# Altium schematic sheet Sensor_Box_PWR_Backup.SchDoc: Title
size 420 x 297 mm; Author: G.Kasprowicz; CompanyName: WUT ISE; DrawnBy: G.Kasprowicz; Organization: WUT ISE; Address1: PW ISE; Address2: Nowowiejska 15/19 00-665 Warsaw; Address3: gkasprow@gmail.com; Revision: 1.0; SheetNumber: -; SheetTotal: -; ModifiedBy: -; CheckedDate: -; Title2: Title2; DivGrp: WUT ISE; Designer: G.Kasprowicz; ModifiedDate: -; ProjectName: Sensor Box
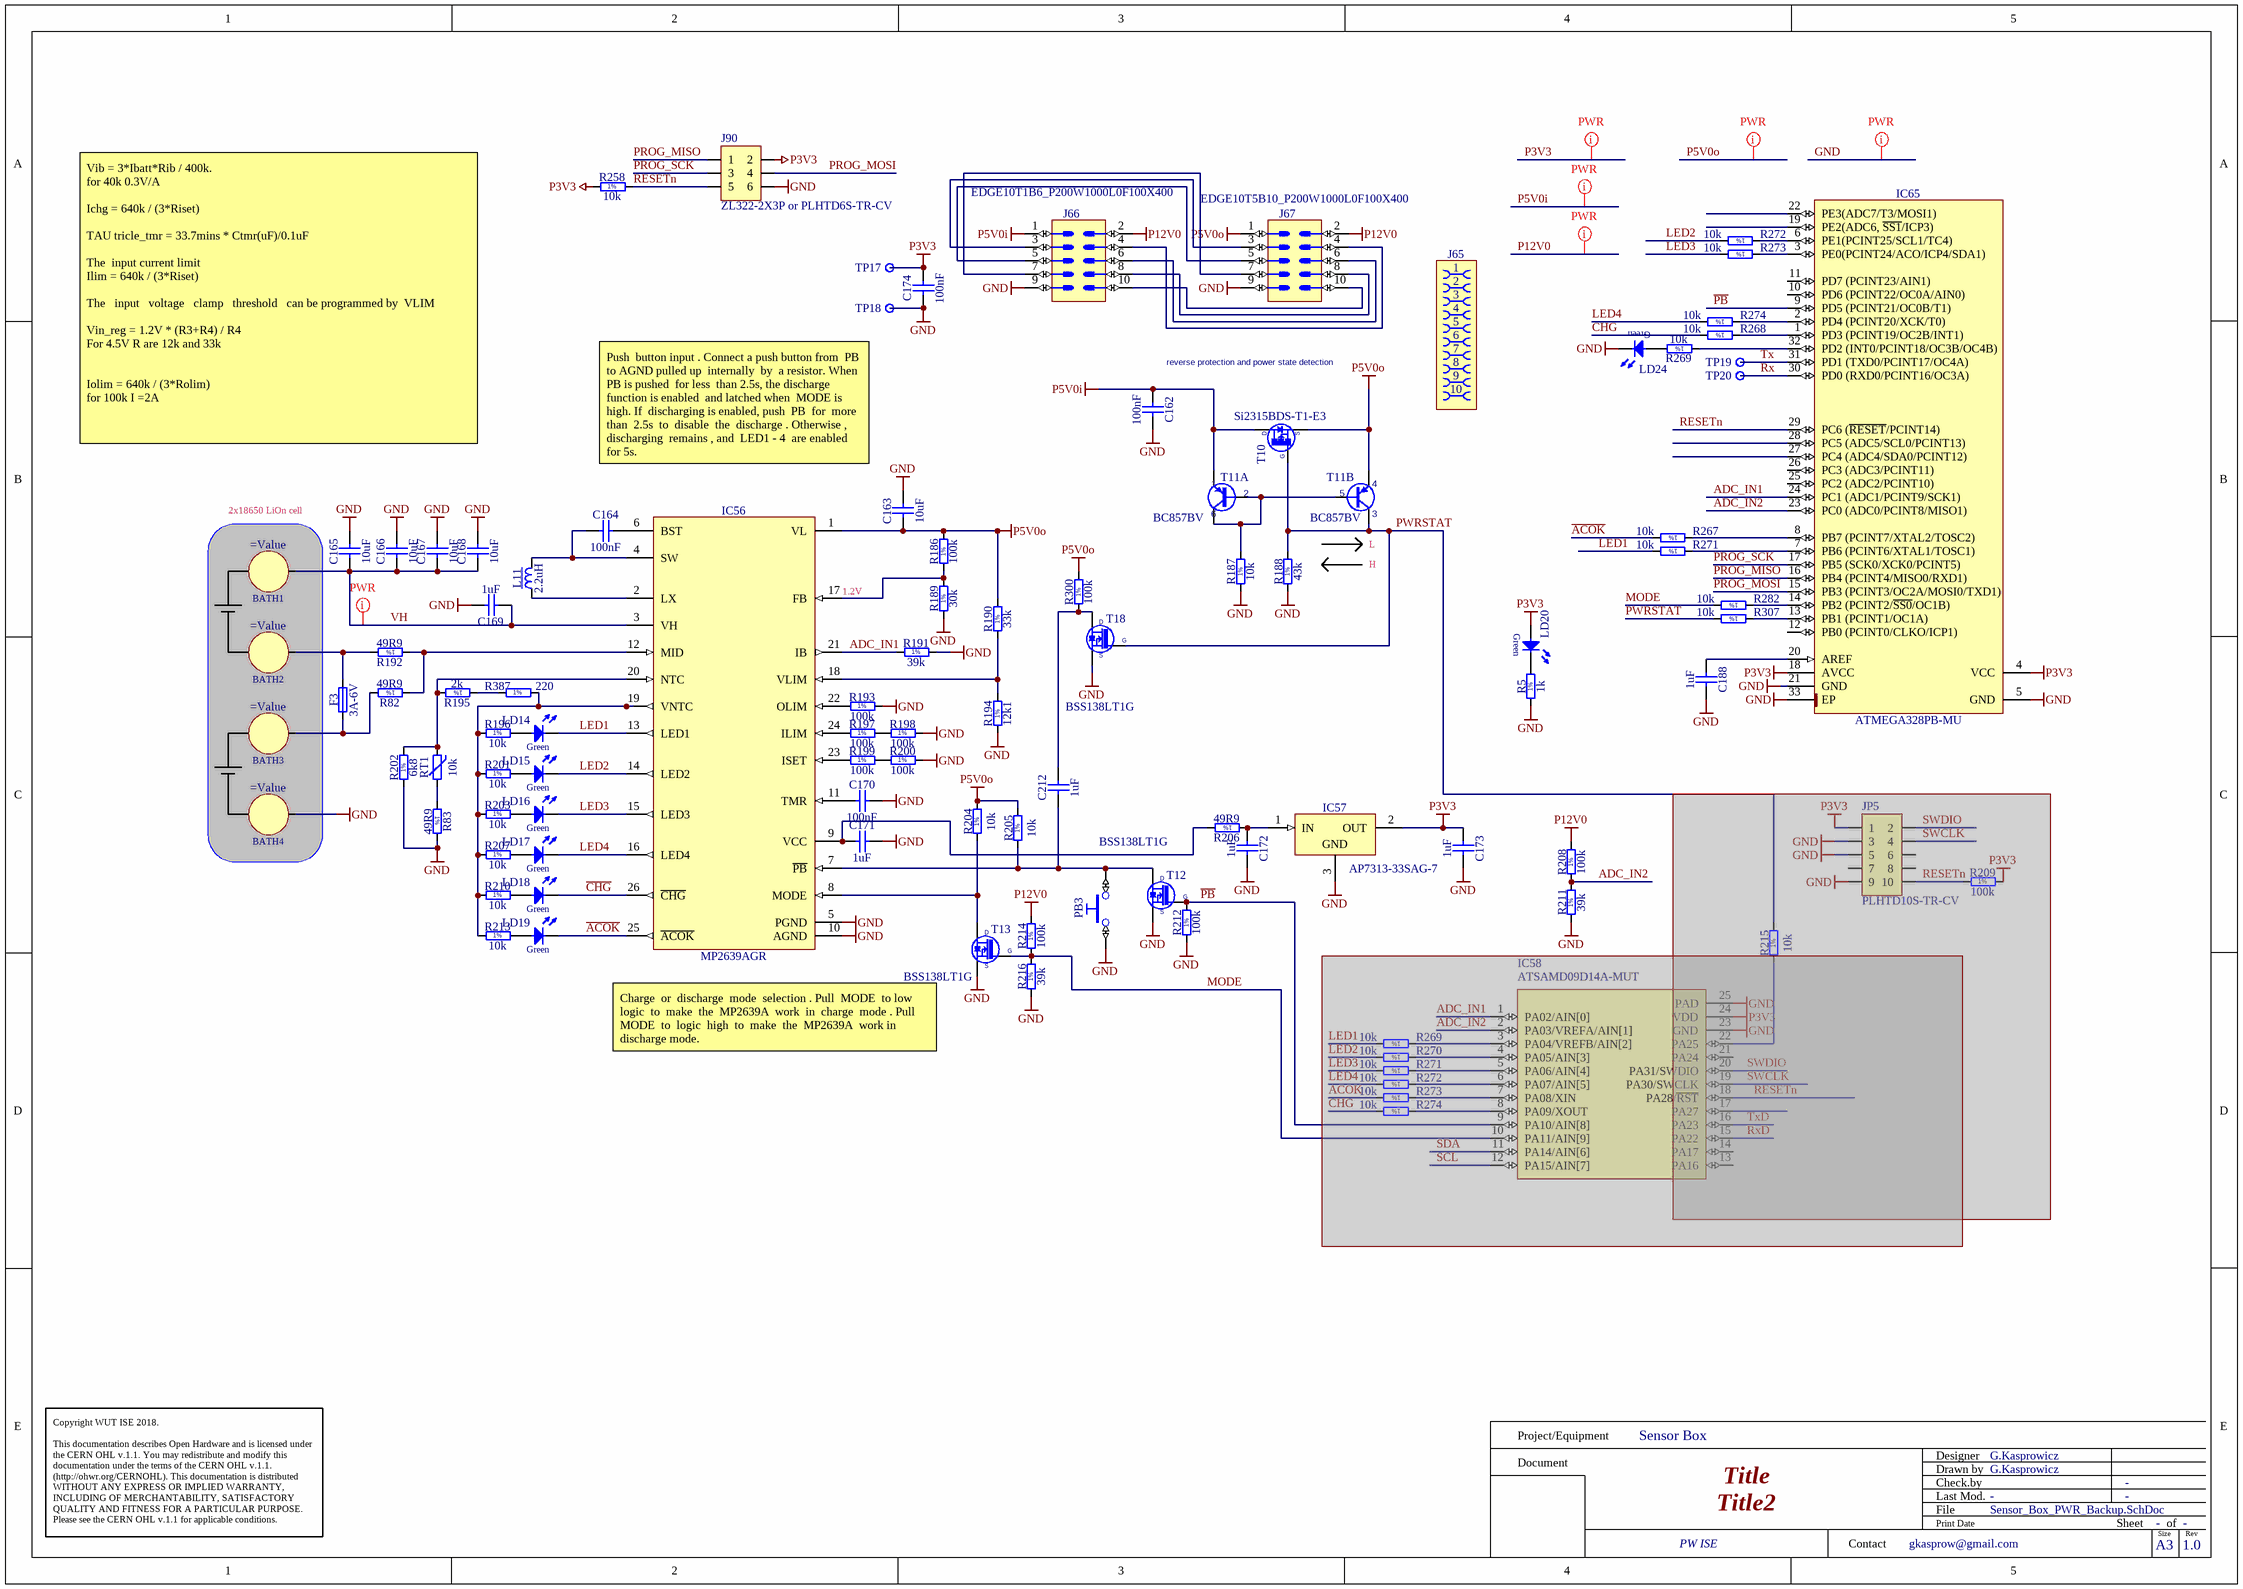
[diagram p0: Sensor_Box_PWR_Backup.SchDoc]

## Parts
(Parts that share a designator on the sheet are numbered #1, #2 ... from top to bottom, then left to right.)
BATH1  (no value)  [BATH_KEYSTONE_54]
BATH2  (no value)  [BATH_KEYSTONE_54]
BATH3  (no value)  [BATH_KEYSTONE_54]
BATH4  (no value)  [BATH_KEYSTONE_54]
C162  100nF  [CAPC1005X55N]
C163  10uF  [CAPC2012X135N]
C164  100nF  [CAPC1005X55N]
C165  10uF  [CAPC2012X135N]
C166  10uF  [CAPC2012X135N]
C167  10uF  [CAPC2012X135N]
C168  10uF  [CAPC2012X135N]
C169  1uF  [CAPC1005X55N]
C170  100nF  [CAPC1005X55N]
C171  1uF  [CAPC1005X55N]
C172  1uF  [CAPC1005X55N]
C173  1uF  [CAPC1005X55N]
C174  100nF  [CAPC1005X55N]
C188  1uF  [CAPC1005X55N]
C212  1uF  [CAPC1005X55N]
F3  3A-6V  [FUSR_BOURNS_MF-SM300]
IC56  MP2639AGR  [MPS_MP2639AGR]
IC57  AP7313-33SAG-7  [SOT95P240X130-3N]
IC58  ATSAMD09D14A-MUT  [QFN50P400X400X80_HS-25N]  (masked out: inside a compile mask, not in the netlist)
IC65  ATMEGA328PB-MU  [QFN50P500X500X100-33N-S325]
J65  (no value)  [AVX_00 9159 010 061 916]
J66  (no value)  [EDGE10T1B6_P200W1000L0F100X400]
J67  (no value)  [EDGE10T5B10_P200W1000L0F100X400]
J90  ZL322-2X3P or PLHTD6S-TR-CV  [ZL322-2X3P]
JP5  PLHTD10S-TR-CV  [PLHTD10S-TR-CV]  (masked out: inside a compile mask, not in the netlist)
L11  2.2uH  [IND_BOURNS_SRU5028]
LD14  Green  [LED_KINGBRIGHT_KPTR3216]  (value not drawn)
LD15  Green  [LED_KINGBRIGHT_KPTR3216]  (value not drawn)
LD16  Green  [LED_KINGBRIGHT_KPTR3216]  (value not drawn)
LD17  Green  [LED_KINGBRIGHT_KPTR3216]  (value not drawn)
LD18  Green  [LED_KINGBRIGHT_KPTR3216]  (value not drawn)
LD19  Green  [LED_KINGBRIGHT_KPTR3216]  (value not drawn)
LD20  Green  [LED_KINGBRIGHT_KPTR3216]  (value not drawn)
LD24  Green  [LED_KINGBRIGHT_KPTR3216]  (value not drawn)
PB3  Push Button  [PB_TYCO_FSMSM]  (value not drawn)
R5  1k  [RESC1005X40N]
R82  49R9  [RESC1005X40N]
R83  49R9  [RESC1005X40N]
R186  100k  [RESC1005X40N]
R187  10k  [RESC1005X40N]
R188  43k  [RESC1608X55N]
R189  30k  [RESC1005X40N]
R190  33k  [RESC1005X40N]
R191  39k  [RESC1005X40N]
R192  49R9  [RESC1005X40N]
R193  100k  [RESC1005X40N]
R194  12k1  [RESC1005X40N]
R195  2k  [RESC1005X40N]
R196  10k  [RESC1005X40N]
R197  100k  [RESC1005X40N]
R198  100k  [RESC1005X40N]
R199  100k  [RESC1005X40N]
R200  100k  [RESC1005X40N]
R201  10k  [RESC1005X40N]
R202  6k8  [RESC1005X40N]
R203  10k  [RESC1005X40N]
R204  10k  [RESC1005X40N]
R205  10k  [RESC1005X40N]
R206  49R9  [RESC1005X40N]
R207  10k  [RESC1005X40N]
R208  100k  [RESC1005X40N]
R209  100k  [RESC1005X40N]  (masked out: inside a compile mask, not in the netlist)
R210  10k  [RESC1005X40N]
R211  39k  [RESC1005X40N]
R212  100k  [RESC1005X40N]
R213  10k  [RESC1005X40N]
R214  100k  [RESC1005X40N]
R215  10k  [RESC1005X40N]  (masked out: inside a compile mask, not in the netlist)
R216  39k  [RESC1005X40N]
R258  10k  [RESC1005X40N]
R267  10k  [RESC1005X40N]
R268  10k  [RESC1005X40N]
R269#1  10k  [RESC1005X40N]
R269#2  10k  [RESC1005X40N]  (masked out: inside a compile mask, not in the netlist)
R270  10k  [RESC1005X40N]  (masked out: inside a compile mask, not in the netlist)
R271#1  10k  [RESC1005X40N]
R271#2  10k  [RESC1005X40N]  (masked out: inside a compile mask, not in the netlist)
R272#1  10k  [RESC1005X40N]
R272#2  10k  [RESC1005X40N]  (masked out: inside a compile mask, not in the netlist)
R273#1  10k  [RESC1005X40N]
R273#2  10k  [RESC1005X40N]  (masked out: inside a compile mask, not in the netlist)
R274#1  10k  [RESC1005X40N]
R274#2  10k  [RESC1005X40N]  (masked out: inside a compile mask, not in the netlist)
R282  10k  [RESC1005X40N]
R300  100k  [RESC1005X40N]
R307  10k  [RESC1005X40N]
R387  220  [RESC1005X40N]
RT1  10k  [THERMC1608X90N]
T10  Si2315BDS-T1-E3  [SOT95P237X112-3N]
T11  BC857BV  [SOTFL50P160X60-6N]  (parts A,B of 2)
T12  BSS138LT1G  [SOT95P240X110-3N]
T13  BSS138LT1G  [SOT95P240X110-3N]
T18  BSS138LT1G  [SOT95P240X110-3N]
TP17  Test Point  [TPS127]  (value not drawn)
TP18  Test Point  [TPS127]  (value not drawn)
TP19  Test Point  [TPS127]  (value not drawn)
TP20  Test Point  [TPS127]  (value not drawn)

## Blocks framed on the sheet
2x18650 LiOn cell: BATH1-BATH4

## Nets
GND: BATH4.1(PLUS) C162.2 C163.2 C165.2 C166.2 C167.2 C168.2 C169.2 C170.2 C171.2 C172.2 C173.2 C174.1 C188.2 IC56.5(PGND) IC56.10(AGND) IC57.3(GND) IC65.5(GND) IC65.21(GND) IC65.33(EP) J66.9 J67.9 J90.6 LD24.1(C) PB3.1 R5.1 R83.2 R187.1 R188.1 R189.1 R191.2 R193.2 R194.1 R198.2 R200.2 R202.1 R211.1 R212.1 R216.1 T12.2(S) T13.2(S) T18.2(S) TP18.1
P3V3: C173.1 C174.2 IC57.2(OUT) IC65.4(VCC) IC65.18(AVCC) J90.2 LD20.2(A) R258.1 TP17.1
P5V0i: C162.1 J66.1 T10.3(D) T11.1(E)
P5V0o: C163.1 IC56.1(VL) J67.1 R186.2 R190.2 R204.2 R205.2 R300.2 T10.2(S) T11.4(E)
P12V0: J66.2 J67.2 R208.2 R214.2
~{ACOK}: IC56.25(~{ACOK}) LD19.1(C) R267.2
ADC_IN1: IC56.21(IB) IC65.24(PC1_(ADC1/PCINT9/SCK1)) R191.1
ADC_IN2: IC65.23(PC0_(ADC0/PCINT8/MISO1)) R208.1 R211.2
~{CHG}: IC56.26(~{CHG}) LD18.1(C) R268.2
LED1: IC56.13(LED1) LD14.1(C) R271#1.2
LED2: IC56.14(LED2) LD15.1(C) R272#1.2
LED3: IC56.15(LED3) LD16.1(C) R273#1.2
LED4: IC56.16(LED4) LD17.1(C) R274#1.2
MODE: R214.1 R216.2 R282.2 T13.1(G)
~{PB}: IC65.9(PD5_(PCINT21/OC0B/T1)) R212.2 T12.1(G)
PROG_MISO: IC65.16(PB4_(PCINT4/MISO0/RXD1)) J90.1
PROG_MOSI: IC65.15(PB3_(PCINT3/OC2A/MOSI0/TXD1)) J90.4
PROG_SCK: IC65.17(PB5_(SCK0/XCK0/PCINT5)) J90.3
PWRSTAT: R188.2 R307.2 T10.1(G) T11.3(C) T18.1(G)
RESETn: IC65.29(PC6_(~{RESET}/PCINT14)) J90.5 R258.2
Rx: IC65.30(PD0_(RXD0/PCINT16/OC3A)) TP20.1
Tx: IC65.31(PD1_(TXD0/PCINT17/OC4A)) TP19.1
VH: BATH1.1(PLUS) C165.1 C166.1 C167.1 C168.1 C169.1 IC56.3(VH)
NetBATH2_1: BATH2.1(PLUS) F3.2 R192.2
NetBATH3_1: BATH3.1(PLUS) F3.1 R82.2
NetC164_1: C164.1 IC56.4(SW) L11.2
NetC164_2: C164.2 IC56.6(BST)
NetC170_1: C170.1 IC56.11(TMR)
NetC171_1: C171.1 IC56.9(VCC) R206.2
NetC172_1: C172.1 IC57.1(IN) R206.1
NetC188_1: C188.1 IC65.20(AREF)
NetC212_1: C212.1 IC56.7(~{PB}) PB3.2 R205.1 T12.3(D)
NetC212_2: C212.2 R300.1 T18.3(D)
NetIC56_2: IC56.2(LX) L11.1
NetIC56_8: IC56.8(MODE) R204.1 T13.3(D)
NetIC56_12: IC56.12(MID) R82.1 R192.1
NetIC56_17: IC56.17(FB) R186.1 R189.2
NetIC56_18: IC56.18(VLIM) R190.1 R194.2
NetIC56_19: IC56.19(VNTC) R196.1 R201.1 R203.1 R207.1 R210.1 R213.1 R387.2
NetIC56_20: IC56.20(NTC) R195.2 R202.2 RT1.2
NetIC56_22: IC56.22(OLIM) R193.1
NetIC56_23: IC56.23(ISET) R199.1
NetIC56_24: IC56.24(ILIM) R197.1
NetIC65_1: IC65.1(PD3_(PCINT19/OC2B/INT1)) R268.1
NetIC65_2: IC65.2(PD4_(PCINT20/XCK/T0)) R274#1.1
NetIC65_3: IC65.3(PE0(PCINT24/ACO/ICP4/SDA1)) R273#1.1
NetIC65_6: IC65.6(PE1(PCINT25/SCL1/TC4)) R272#1.1
NetIC65_7: IC65.7(PB6_(PCINT6/XTAL1/TOSC1)) R271#1.1
NetIC65_8: IC65.8(PB7_(PCINT7/XTAL2/TOSC2)) R267.1
NetIC65_13: IC65.13(PB1_(PCINT1/OC1A)) R307.1
NetIC65_14: IC65.14(PB2_(PCINT2/~{SS0}/OC1B)) R282.1
NetIC65_32: IC65.32(PD2_(INT0/PCINT18/OC3B/OC4B)) R269#1.1
NetJ66_3: J66.3 J67.3
NetJ66_4: J66.4 J67.4
NetJ66_5: J66.5 J67.5
NetJ66_6: J66.6 J67.6
NetJ66_7: J66.7 J67.7
NetJ66_8: J66.8 J67.8
NetJ66_10: J66.10 J67.10
NetLD14_2: LD14.2(A) R196.2
NetLD15_2: LD15.2(A) R201.2
NetLD16_2: LD16.2(A) R203.2
NetLD17_2: LD17.2(A) R207.2
NetLD18_2: LD18.2(A) R210.2
NetLD19_2: LD19.2(A) R213.2
NetLD20_1: LD20.1(C) R5.2
NetLD24_2: LD24.2(A) R269#1.2
NetR83_1: R83.1 RT1.1
NetR187_2: R187.2 T11.2(B) T11.5(B) T11.6(C)
NetR195_1: R195.1 R387.1
NetR197_2: R197.2 R198.1
NetR199_2: R199.2 R200.1

Not connected (* = marked no-connect by the designer): IC65 10(PD6_(PCINT22/OC0A/AIN0)) 11(PD7_(PCINT23/AIN1)) 12(PB0_(PCINT0/CLKO/ICP1)) 19(PE2(ADC6,_~{SS1}/ICP3)) 22(PE3(ADC7/T3/MOSI1)) 25(PC2_(ADC2/PCINT10)) 26(PC3_(ADC3/PCINT11)) 27(PC4_(ADC4/SDA0/PCINT12)) 28(PC5_(ADC5/SCL0/PCINT13))

## Layout directives
net class PWR: GND, P3V3, P5V0i, P5V0o, P12V0, VH

## Notes on the sheet
- (near C162) reverse protection and power state detection
- Vib = 3*Ibatt*Rib / 400k.
  for 40k 0.3V/A
  Ichg = 640k / (3*Riset)
  TAU tricle_tmr = 33.7mins * Ctmr(uF)/0.1uF
  The  input current limit
  Ilim = 640k / (3*Riset)
  The   input   voltage   clamp   threshold   can be programmed by  VLIM
  Vin_reg = 1.2V * (R3+R4) / R4
  For 4.5V R are 12k and 33k
  Iolim = 640k / (3*Rolim)
  for 100k I =2A
- Push  button input . Connect a push button from  PB  to AGND pulled up  internally  by  a resistor. When  PB is pushed  for less  than 2.5s, the discharge function is enabled  and latched when  MODE is high. If  discharging is enabled, push  PB  for  more  than  2.5s  to  disable  the  discharge . Otherwise , discharging  remains , and  LED1 - 4  are enabled for 5s.
- (near IC56) 1.2V
- (near T11) L
- H
- Charge  or  discharge  mode  selection . Pull  MODE  to low  logic  to  make  the  MP2639A  work  in  charge  mode . Pull  MODE  to  logic  high  to  make  the  MP2639A  work in  discharge mode.
- Project/Equipment
- Document
- Designer
- Drawn by
- Check.by
- Copyright WUT ISE 2018.
  This documentation describes Open Hardware and is licensed under the CERN OHL v.1.1. You may redistribute and modify this documentation under the terms of the CERN OHL v.1.1. (http://ohwr.org/CERNOHL). This documentation is distributed WITHOUT ANY EXPRESS OR IMPLIED WARRANTY, INCLUDING OF MERCHANTABILITY, SATISFACTORY QUALITY AND FITNESS FOR A PARTICULAR PURPOSE. Please see the CERN OHL v.1.1 for applicable conditions.
- Contact
- File
- Last Mod.
- Print Date
- Sheet
- Size
- A3
- of
- Rev
- (in symbol R0402_1K_1%_0.0625W_100PPM) 1%
- (in symbol R0402_2K_1%_0.0625W_100PPM) 1%
- (in symbol R0402_6K8_1%_0.0625W_100PPM) 1%
- (in symbol R0402_10K_1%_0.0625W_100PPM) 1%
- (in symbol R0402_12K1_1%_0.0625W_100PPM) 1%
- (in symbol R0402_30K_1%_0.0625W_100PPM) 1%
- (in symbol R0402_33K_1%_0.0625W_100PPM) 1%
- (in symbol R0402_39K_1%_0.0625W_100PPM) 1%
- (in symbol R0402_49R9_1%_0.0625W_100PPM) 1%
- (in symbol R0402_100K_1%_0.0625W_100PPM) 1%
- (in symbol R0402_220R_1%_0.0625W_100PPM) 1%
- (in symbol R0603_43K_1%_0.1W_100PPM) 1%

## Library data of the parts
BATH1-BATH4 = BATH_KEYSTONE_54: Battery Holder whit 1 Pin; Part Description: Clip for 16mm - 19mm Diameter Battery; Manufacturer Part Number: 54; PressFit: No; Part Number: BATH_KEYSTONE_54; Component Kind: Standard; Component Type: Standard; Pin Count: 1; PackageDescription: Clip for 16mm - 19mm Diameter Battery; Family: Battery; Mounted: Yes; Socket: No; SMD: No; Sense: No; Manufacturer: KEYSTONE; ComponentHeight: 16.59mm; HelpURL: \\cern.ch\dfs\Applications\Altium\Datasheets\BATH_KEYSTONE_54.pdf; Author: CERN DEM JLC; CreateDate: 21.03.2018; LatestRevisionDate: 21.03.2018
C162 C164 C170 C174 = CC0402_100NF_16V_10%_X5R: Non-polarised capacitor; Part Description: SMD Multilayer Chip Ceramic Capacitor; Manufacturer: GENERIC; Manufacturer1 Part Number: GRM155R61C104KA88D; Voltage: 16V; TC: X5R; Tolerance: ±10%; Part Number: CC0402_100NF_16V_10%_X5R; Component Kind: Standard; Component Type: Standard; Pin Count: 2; Value: 100nF; Status: None; Manufacturer Part Number: CC0402_100NF_16V_10%_X5R; Case: 0402; Mounted: Yes; Socket: No; SMD: Yes; Sense: No; Manufacturer1 Example: MURATA; Manufacturer1 ComponentHeight: 0.55mm; HelpURL: \\cern.ch\dfs\Applications\Altium\Datasheets\CC0402_X5R_MURATA_GRM.pdf; Author: CERN DEM JLC; CreateDate: 10.12.2013; LatestRevisionDate: 10.12.2013
C163 C165-C168 = CC0805_10UF_16V_10%_X5R: Non-polarised capacitor; Part Description: SMD Multilayer Chip Ceramic Capacitor; Manufacturer: GENERIC; Manufacturer1 Part Number: C0805C106K4PAC; Voltage: 16V; TC: X5R; Tolerance: ±10%; Part Number: CC0805_10UF_16V_10%_X5R; Component Kind: Standard; Component Type: Standard; Pin Count: 2; Value: 10uF; Status: Preferred; Manufacturer Part Number: CC0805_10UF_16V_10%_X5R; Case: 0805; Mounted: Yes; Socket: No; SMD: Yes; Sense: No; Manufacturer1 Example: KEMET; Manufacturer1 ComponentHeight: 1.4mm; HelpURL: \\cern.ch\dfs\Applications\Altium\Datasheets\CC1206_X5R_KEMET.pdf; Author: CERN DEM JLC; CreateDate: 03.12.2007; LatestRevisionDate: 03.12.2007
C169 C171-C173 C188 C212 = CC0402_1UF_16V_10%_X5R: Non-polarised capacitor; Part Description: SMD Multilayer Chip Ceramic Capacitor; Manufacturer: GENERIC; Manufacturer1 Part Number: C1005X5R1C105KT; Voltage: 16V; TC: X5R; Tolerance: ±10%; Part Number: CC0402_1UF_16V_10%_X5R; Component Kind: Standard; Component Type: Standard; Pin Count: 2; Value: 1uF; Status: Preferred; Manufacturer Part Number: CC0402_1UF_16V_10%_X5R; Case: 0402; Mounted: Yes; Socket: No; SMD: Yes; Sense: No; Manufacturer1 Example: TDK; Manufacturer1 ComponentHeight: 0.55mm; HelpURL: \\cern.ch\dfs\Applications\Altium\Datasheets\CC0402_X5R_TDK_C.pdf; Author: CERN DEM JLC; CreateDate: 25.10.2012; LatestRevisionDate: 25.10.2012
F3 = FUSR_BOURNS_MF-SM300-2: Fuse; Part Description: PTC Resettable Fuse; Manufacturer: BOURNS; PressFit: No; Part Number: FUSR_BOURNS_MF-SM300-2; Component Kind: Standard; Component Type: Standard; Pin Count: 2; PackageDescription: PolySwitch, 2-Leads, Body 7.35x5.12mm Nominal; Family: Fuses Resettable; Mounted: Yes; Socket: No; SMD: Yes; Sense: No; Value: 3A-6V; Manufacturer Part Number: MF-SM300-2; ComponentHeight: 3mm; HelpURL: \\cern.ch\dfs\Applications\Altium\Datasheets\FUSR_BOURNS_MF-SM300-2.pdf; Author: CERN DEM JLC; CreateDate: 15.08.2013; LatestRevisionDate: 15.08.2013
IC56 = MP2639AGR: 2-Cell Li-Ion or Li-Polymer Switching Charger Compatible with 5V Input and Integrated, Bidirectional Charge/Discharge; Manufacturer: MPS (MONOLITIC  POWER SYSTEMS); PressFit: No; Bonding: No; Part Number: MP2639AGR; Component Kind: Standard; Component Type: Standard; Device: MP2639AGR; PackageDescription: MPS QFN-26 (4mmx4mm) Case; Part Description: 2-Cell Li-Ion or Li-Polymer Switching Charger Compatible with 5V Input and Integrated, Bidirectional Charge/Discharge; Manufacturer Part Number: MP2639AGR; Pin Count: 26; Case: QFN26; Mounted: Yes; Socket: No; SMD: Yes; Sense: No; ComponentHeight: 1mm; Author: CERN DEM JLC; HelpURL: \\cern.ch\dfs\Applications\Altium\Datasheets\MP2639AGR.pdf; CreateDate: 21.03.2018; LatestRevisionDate: 21.03.2018
IC57 = AP7313-33SAG-7: 3-Terminal Regulator 1=IN 2=OUT 3=GND; Part Description: 3.3V, 150mA Low Quiescent Current, Fast Transient Low Dropout Linear Regulator; Manufacturer: DIODES INCORPORATED; PressFit: No; Bonding: No; Part Number: AP7313-33SAG-7; Component Kind: Standard; Component Type: Standard; Device: AP7313-33SAG-7; PackageDescription: SOT23 3-Leads, Pitch 0.95mm - Body 1.3x2.9mm, IPC Medium Density; Manufacturer Part Number: AP7313-33SAG-7; Pin Count: 3; Case: SOT23; Mounted: Yes; Socket: No; SMD: Yes; Sense: No; ComponentHeight: 1.35mm; HelpURL: \\cern.ch\dfs\Applications\Altium\Datasheets\AP7313-33SAG-7.pdf; Author: CERN DEM JLC; CreateDate: 20.03.2018; LatestRevisionDate: 20.03.2018
IC58 = UPC_ATSAMD09D: 32-bit ARM®-based Cortex®-M4 core Microcontroller, 1.62V to 3.6V, 120MHz, 256KB Flash, 64KB of SRAM, 48 QFP, Industrial Grade (-40°C to 85°C); Part Description: ATSAMD09D14A-MUT  SMART SAMD09, SMART ARM based Microcontrollers, 32 bity, 48 MHz, 16 KB, 4 KB; Manufacturer: Microchip; PressFit: No; Bonding: No; Part Number: ATSAMD09D14A-MUT; Component Kind: Standard; Component Type: Standard; Device: ATSAMD09D14A-MUT; PackageDescription: QFN, 24-Leads, Body 4.00x4.00mm, Pitch 0.50mm, Thermal Pad 2.60x2.60mm, IPC Medium Density; Manufacturer Part Number: ATSAMD09D14A-MUT; Pin Count: 24; Case: QFN24; Mounted: Yes; Socket: No; SMD: Yes; Sense: No; ComponentHeight: 1.6mm; HelpURL: \\cern.ch\dfs\Applications\Altium\Datasheets\ATSAM4S4AA-AU.pdf; Author: GK; CreateDate: 16.12.2017; LatestRevisionDate: 16.12.2017
IC65 = UPC_ATMEGA328PB-MU: 8-bit AVR 20MHz Microcontroller With 32K Bytes In-System  Programmable  Flash; Part Description: 8-bit AVR Microcontroller, 32KB Flash, 1KB EEPROM, 2KB SRAM, 32-pin MLF, Industrial Grade (-40°C to 85°C); Manufacturer: ATMEL; PressFit: No; Bonding: No; Part Number: ATMEGA328PB-MU; Component Kind: Standard; Component Type: Standard; Device: ATMEGA328PB-MU; PackageDescription: QFN, (MO-220-VHHD-2) 0.50mm pitch,square; 8 pin X 8 pin, 5mm X 5mm X 1.00mm H body (w/thermal tab 3.25 X 3.25mm),  IPC Medium Density; Manufacturer Part Number: ATMEGA328PB-MU; Pin Count: 33; Case: QFN32; Mounted: Yes; Socket: No; SMD: Yes; Sense: No; ComponentHeight: 1mm; HelpURL: \\cern.ch\dfs\Applications\Altium\Datasheets\ATMEGA328P-MU.pdf; Author: GK; CreateDate: 2011-02-08; LatestRevisionDate: 2014-07-02
J65 = AVX_00 9159 010 061 916: Open Ended Card Edge Connector, 9159 Series; Part Description: 10 Contacts, 2mm Pitch, Open Ended Card Edge Connector, 9159 Series; Manufacturer: AVX; PressFit: No; Part Number: AVX_00 9159 010 061 916; Component Kind: Standard; Component Type: Standard; Pin Count: 10; Mounted: Yes; Socket: No; SMD: No; Sense: No; Status: None; Manufacturer Part Number: 00 9159 010 061 916; ComponentHeight: 1.6mm; HelpURL: \\cern.ch\dfs\Applications\Altium\Datasheets\AVX_00 9159 010 061 916.pdf; Author: CERN DEM MR; CreateDate: 13.02.2018; LatestRevisionDate: 13.02.2018
J66 = EDGE10T1B6_P200W1000L0F100X400: PCB Edge Connector 10 (2x5); Part Description: 10 Contacts Board Edge Connector, Pitch 2mm, Length 0mm, Width 10mm, Finger Lenght 4mm, Finger Width 1mm; Mounted: No; PressFit: No; Part Number: EDGE10T1B6_P200W1000L0F100X400; Component Kind: Standard (No BOM); Component Type: Standard (No BOM); Pin Count: 10; Socket: No; SMD: No; Sense: No; Status: None; ComponentHeight: 0mm; HelpURL: \\cern.ch\dfs\Applications\Altium\Datasheets\EDGE10T1B6_P200W1000L0F100X400.pdf; Author: CERN DEM MR; CreateDate: 14.02.2018; LatestRevisionDate: 14.02.2018
J67 = EDGE10T5B10_P200W1000L0F100X400: PCB Edge Connector 10 (2x5); Part Description: 10 Contacts Board Edge Connector, Pitch 2mm, Length 0mm, Width 10mm, Finger Lenght 4mm, Finger Width 1mm; Mounted: No; PressFit: No; Part Number: EDGE10T5B10_P200W1000L0F100X400; Component Kind: Standard (No BOM); Component Type: Standard (No BOM); Pin Count: 10; Socket: No; SMD: No; Sense: No; Status: None; ComponentHeight: 0mm; HelpURL: \\cern.ch\dfs\Applications\Altium\Datasheets\EDGE10T5B10_P200W1000L0F100X400.pdf; Author: CERN DEM MR; CreateDate: 14.02.2018; LatestRevisionDate: 14.02.2018
J90 = CON_2x3 1.27 SMT Male: 1.27 mm dual row goldpin (Maritex)
JP5 = CON_2x5 1.27 SMT Male: 1.27 mm dual row goldpin (Maritex)
L11 = IND_2.2UH_30%_BOURNS_SRU5028: Inductor With Core; Part Description: Shielded SMD Power Inductor; Manufacturer: BOURNS; Manufacturer Part Number: SRU5028-2R2Y; Power: 3.2A; Resistance: 0.021R; Tolerance: ±30%; Part Number: IND_2.2UH_30%_BOURNS_SRU5028; Component Kind: Standard; Component Type: Standard; Pin Count: 2; Value: 2.2uH; Status: None; Mounted: Yes; Socket: No; SMD: Yes; Sense: No; ComponentHeight: 3mm; HelpURL: \\cern.ch\dfs\Applications\Altium\Datasheets\IND_BOURNS_SRU5028.pdf; Author: CERN DEM BC; CreateDate: 02.09.2015; LatestRevisionDate: 02.09.2015
LD14-LD20 LD24 = LED_KINGBRIGHT_KPTR-3216CGCK: LED Green 1A 2C; Part Description: Reverse Mount LED 1.4x1.6mm Green; PressFit: No; Bonding: No; Part Number: LED_KINGBRIGHT_KPTR-3216CGCK; Component Kind: Standard; Component Type: Standard; Color: Green; PackageDescription: Reverse Mount LED 3216, Hole 2.1x2.3mm 0.35mm Height; Manufacturer: KINGBRIGHT; Manufacturer Part Number: KPTR-3216CGCK; Pin Count: 2; Mounted: Yes; Socket: No; SMD: Yes; Sense: No; ComponentHeight: 0.35mm; HelpURL: \\cern.ch\dfs\Applications\Altium\Datasheets\LED_KINGBRIGHT_KPTR-3216CGCK.pdf; Author: CERN DEM MR; CreateDate: 15.02.2016; LatestRevisionDate: 15.02.2016
PB3 = PB_TYCO_FSMSM: Push-Button Switch SPDT; Part Description: 12VDC 50mA SPST Tactile  Push-Button Switch; Manufacturer: TYCO ELECTRONICS; Manufacturer Part Number: FSMSM or 1437566-3; PressFit: No; Part Number: PB_TYCO_FSMSM; Component Kind: Standard; Component Type: Standard; Pin Count: 2; PackageDescription: Body 3.5x6.0mm, Pushbutton Switch,  TYCO ALCOSWITCH FSMSM Serie; Family: Push Button; Mounted: Yes; Socket: No; SMD: Yes; Sense: No; Status: None; ComponentHeight: 4.3mm; HelpURL: \\cern.ch\dfs\Applications\Altium\Datasheets\PB_TYCO_FSMSM.pdf; Author: CERN DEM JLC; CreateDate: 30.06.2008; LatestRevisionDate: 21.06.2012
R5 = R0402_1K_1%_0.0625W_100PPM: Resistor - 1%; Part Description: General Purpose Thick Film Chip Resistor; Manufacturer: GENERIC; Manufacturer1 Part Number: 232270671002L; TC: ±100ppm/°C; PressFit: No; Part Number: R0402_1K_1%_0.0625W_100PPM; Component Kind: Standard; Component Type: Standard; Pin Count: 2; Value: 1k; Status: Not Recommended; Power: 0.0625W; Tolerance: ±1%; Manufacturer Part Number: R0402_1K_1%_0.0625W_100PPM; Case: 0402; Mounted: Yes; Sense: No; Socket: No; SMD: Yes; Manufacturer1 Example: YAGEO PHYCOMP; Manufacturer1 ComponentHeight: 0.4mm; HelpURL: \\cern.ch\dfs\Applications\Altium\Datasheets\R0402_Phycomp_RC0402.pdf; Author: CERN DEM JLC; CreateDate: 03.12.2007; LatestRevisionDate: 17.10.2012
R82 R83 R192 R206 = R0402_49R9_1%_0.0625W_100PPM: Resistor - 1%; Part Description: General Purpose Thick Film Chip Resistor; Manufacturer: GENERIC; Manufacturer1 Part Number: 232270674999L or RC0402FR-0749R9L; TC: ±100ppm/°C; Table: Resistors SMD; Part Number: R0402_49R9_1%_0.0625W_100PPM; Component Kind: Standard; Component Type: Standard; Pin Count: 2; Value: 49R9; Status: Not recommended; Power: 0.0625W; Tolerance: ±1%; Manufacturer Part Number: R0402_49R9_1%_0.0625W_100PPM; Case: 0402; Mounted: Yes; Socket: No; SMD: Yes; Manufacturer1 Example: YAGEO PHYCOMP; Manufacturer1 ComponentHeight: 0.4mm; HelpURL: \\cern.ch\dfs\Applications\Altium\Datasheets\R0402_Phycomp_RC0402.pdf; Author: CERN DEM JLC; CreateDate: 2012-10-24; LatestRevisionDate: 2012-10-24
R186 R193 R197-R200 R208 R209 R212 R214 R300 = R0402_100K_1%_0.0625W_100PPM: Resistor - 1%; Part Description: General Purpose Thick Film Chip Resistor; Manufacturer: GENERIC; Manufacturer1 Part Number: 232270671004L; TC: ±100ppm/°C; PressFit: No; Part Number: R0402_100K_1%_0.0625W_100PPM; Component Kind: Standard; Component Type: Standard; Pin Count: 2; Value: 100k; Status: Not Recommended; Power: 0.0625W; Tolerance: ±1%; Manufacturer Part Number: R0402_100K_1%_0.0625W_100PPM; Case: 0402; Mounted: Yes; Sense: No; Socket: No; SMD: Yes; Manufacturer1 Example: YAGEO PHYCOMP; Manufacturer1 ComponentHeight: 0.4mm; HelpURL: \\cern.ch\dfs\Applications\Altium\Datasheets\R0402_Phycomp_RC0402.pdf; Author: CERN DEM JLC; CreateDate: 03.12.2007; LatestRevisionDate: 17.10.2012
R187 R196 R201 R203-R205 R207 R210 R213 R215 R258 R267 R268 R269#1 R269#2 R270 R271#1 R271#2 R272#1 R272#2 R273#1 R273#2 R274#1 R274#2 R282 R307 = R0402_10K_1%_0.0625W_100PPM: Resistor - 1%; Part Description: General Purpose Thick Film Chip Resistor; Manufacturer: GENERIC; Manufacturer1 Part Number: 232270671003L; TC: ±100ppm/°C; PressFit: No; Part Number: R0402_10K_1%_0.0625W_100PPM; Component Kind: Standard; Component Type: Standard; Pin Count: 2; Value: 10k; Status: Not Recommended; Power: 0.0625W; Tolerance: ±1%; Manufacturer Part Number: R0402_10K_1%_0.0625W_100PPM; Case: 0402; Mounted: Yes; Sense: No; Socket: No; SMD: Yes; Manufacturer1 Example: YAGEO PHYCOMP; Manufacturer1 ComponentHeight: 0.4mm; HelpURL: \\cern.ch\dfs\Applications\Altium\Datasheets\R0402_Phycomp_RC0402.pdf; Author: CERN DEM JLC; CreateDate: 03.12.2007; LatestRevisionDate: 17.10.2012
R188 = R0603_43K_1%_0.1W_100PPM: Resistor - 1%; Part Description: General Purpose Thick Film Chip Resistor; Manufacturer: GENERIC; Manufacturer1 Part Number: NRC06F4302TRF; Power: 0.1W; TC: ±100ppm/°C; PressFit: No; Part Number: R0603_43K_1%_0.1W_100PPM; Component Kind: Standard; Component Type: Standard; Pin Count: 2; Value: 43k; Status: Preferred; Tolerance: ±1%; Manufacturer Part Number: R0603_43K_1%_0.1W_100PPM; Case: 0603; Mounted: Yes; Sense: No; Socket: No; SMD: Yes; Manufacturer1 Example: NIC COMPONENT; Manufacturer1 ComponentHeight: 0.55mm; HelpURL: \\cern.ch\dfs\Applications\Altium\Datasheets\R0603_NIC_NRC.pdf; Author: CERN DEM JLC; CreateDate: 03.12.2007; LatestRevisionDate: 13.03.2008
R189 = R0402_30K_1%_0.0625W_100PPM: Resistor - 1%; Part Description: General Purpose Thick Film Chip Resistor; Manufacturer: GENERIC; Manufacturer1 Part Number: 232270673003L; TC: ±100ppm/°C; PressFit: No; Part Number: R0402_30K_1%_0.0625W_100PPM; Component Kind: Standard; Component Type: Standard; Pin Count: 2; Value: 30k; Status: Not Recommended; Power: 0.0625W; Tolerance: ±1%; Manufacturer Part Number: R0402_30K_1%_0.0625W_100PPM; Case: 0402; Mounted: Yes; Sense: No; Socket: No; SMD: Yes; Manufacturer1 Example: YAGEO PHYCOMP; Manufacturer1 ComponentHeight: 0.4mm; HelpURL: \\cern.ch\dfs\Applications\Altium\Datasheets\R0402_Phycomp_RC0402.pdf; Author: CERN DEM JLC; CreateDate: 03.12.2007; LatestRevisionDate: 17.10.2012
R190 = R0402_33K_1%_0.0625W_100PPM: Resistor - 1%; Part Description: General Purpose Thick Film Chip Resistor; Manufacturer: GENERIC; Manufacturer1 Part Number: 232270673303L; TC: ±100ppm/°C; PressFit: No; Part Number: R0402_33K_1%_0.0625W_100PPM; Component Kind: Standard; Component Type: Standard; Pin Count: 2; Value: 33k; Status: Not Recommended; Power: 0.0625W; Tolerance: ±1%; Manufacturer Part Number: R0402_33K_1%_0.0625W_100PPM; Case: 0402; Mounted: Yes; Sense: No; Socket: No; SMD: Yes; Manufacturer1 Example: YAGEO PHYCOMP; Manufacturer1 ComponentHeight: 0.4mm; HelpURL: \\cern.ch\dfs\Applications\Altium\Datasheets\R0402_Phycomp_RC0402.pdf; Author: CERN DEM JLC; CreateDate: 03.12.2007; LatestRevisionDate: 17.10.2012
R191 R211 R216 = R0402_39K_1%_0.0625W_100PPM: Resistor - 1%; Part Description: General Purpose Thick Film Chip Resistor; Manufacturer: GENERIC; Manufacturer1 Part Number: 232270673903; TC: ±100ppm/°C; PressFit: No; Part Number: R0402_39K_1%_0.0625W_100PPM; Component Kind: Standard; Component Type: Standard; Pin Count: 2; Value: 39k; Status: Not Recommended; Power: 0.0625W; Tolerance: ±1%; Manufacturer Part Number: R0402_39K_1%_0.0625W_100PPM; Case: 0402; Mounted: Yes; Sense: No; Socket: No; SMD: Yes; Manufacturer1 Example: YAGEO PHYCOMP; Manufacturer1 ComponentHeight: 0.4mm; HelpURL: \\cern.ch\dfs\Applications\Altium\Datasheets\R0402_Phycomp_RC0402.pdf; Author: CERN DEM JLC; CreateDate: 03.12.2007; LatestRevisionDate: 17.10.2012
R194 = R0402_12K1_1%_0.0625W_100PPM: Resistor - 1%; Part Description: General Purpose Thick Film Chip Resistor; Manufacturer: GENERIC; Manufacturer1 Part Number: 232270671213L or RC0402FR-0712K1L; TC: ±100ppm/°C; PressFit: No; Part Number: R0402_12K1_1%_0.0625W_100PPM; Component Kind: Standard; Component Type: Standard; Pin Count: 2; Value: 12k1; Status: Not Recommended; Power: 0.0625W; Tolerance: ±1%; Manufacturer Part Number: R0402_12K1_1%_0.0625W_100PPM; Case: 0402; Mounted: Yes; Sense: No; Socket: No; SMD: Yes; Manufacturer1 Example: YAGEO PHYCOMP; Manufacturer1 ComponentHeight: 0.4mm; HelpURL: \\cern.ch\dfs\Applications\Altium\Datasheets\R0402_Phycomp_RC0402.pdf; Author: CERN DEM JLC; CreateDate: 24.10.2012; LatestRevisionDate: 24.10.2012
R195 = R0402_2K_1%_0.0625W_100PPM: Resistor - 1%; Part Description: General Purpose Thick Film Chip Resistor; Manufacturer: GENERIC; Manufacturer1 Part Number: 232270672002L; TC: ±100ppm/°C; PressFit: No; Part Number: R0402_2K_1%_0.0625W_100PPM; Component Kind: Standard; Component Type: Standard; Pin Count: 2; Value: 2k; Status: Not Recommended; Power: 0.0625W; Tolerance: ±1%; Manufacturer Part Number: R0402_2K_1%_0.0625W_100PPM; Case: 0402; Mounted: Yes; Sense: No; Socket: No; SMD: Yes; Manufacturer1 Example: YAGEO PHYCOMP; Manufacturer1 ComponentHeight: 0.4mm; HelpURL: \\cern.ch\dfs\Applications\Altium\Datasheets\R0402_Phycomp_RC0402.pdf; Author: CERN DEM JLC; CreateDate: 03.12.2007; LatestRevisionDate: 17.10.2012
R202 = R0402_6K8_1%_0.0625W_100PPM: Resistor - 1%; Part Description: General Purpose Thick Film Chip Resistor; Manufacturer: GENERIC; Manufacturer1 Part Number: 232270676802L; TC: ±100ppm/°C; PressFit: No; Part Number: R0402_6K8_1%_0.0625W_100PPM; Component Kind: Standard; Component Type: Standard; Pin Count: 2; Value: 6k8; Status: Not Recommended; Power: 0.0625W; Tolerance: ±1%; Manufacturer Part Number: R0402_6K8_1%_0.0625W_100PPM; Case: 0402; Mounted: Yes; Sense: No; Socket: No; SMD: Yes; Manufacturer1 Example: YAGEO PHYCOMP; Manufacturer1 ComponentHeight: 0.4mm; HelpURL: \\cern.ch\dfs\Applications\Altium\Datasheets\R0402_Phycomp_RC0402.pdf; Author: CERN DEM JLC; CreateDate: 03.12.2007; LatestRevisionDate: 17.10.2012
R387 = R0402_220R_1%_0.0625W_100PPM: Resistor - 1%; Part Description: General Purpose Thick Film Chip Resistor; Manufacturer: GENERIC; Manufacturer1 Part Number: 232270672201L; TC: ±100ppm/°C; PressFit: No; Part Number: R0402_220R_1%_0.0625W_100PPM; Component Kind: Standard; Component Type: Standard; Pin Count: 2; Value: 220; Status: Not Recommended; Power: 0.0625W; Tolerance: ±1%; Manufacturer Part Number: R0402_220R_1%_0.0625W_100PPM; Case: 0402; Mounted: Yes; Sense: No; Socket: No; SMD: Yes; Manufacturer1 Example: YAGEO PHYCOMP; Manufacturer1 ComponentHeight: 0.4mm; HelpURL: \\cern.ch\dfs\Applications\Altium\Datasheets\R0402_Phycomp_RC0402.pdf; Author: CERN DEM JLC; CreateDate: 03.12.2007; LatestRevisionDate: 17.10.2012
RT1 = THERM_NTC_10K_EPCOS_B57330V2103J260: Thermistor NTC (Negative Temperature Coefficient); Part Description: SMD NTC Thermistor for Temperature Measurement; Manufacturer: EPCOS; Power: 180mW; Tolerance: ±5%; Part Number: THERM_NTC_10K_EPCOS_B57330V2103J260; Component Kind: Standard; Component Type: Standard; Pin Count: 2; Value: 10k; Status: None; Manufacturer Part Number: B57330V2103J260; Case: 0603; Mounted: Yes; Socket: No; SMD: Yes; Sense: No; ComponentHeight: 0.9mm; HelpURL: \\cern.ch\dfs\Applications\Altium\Datasheets\THERM_EPCOS_B573xxV2.pdf; Author: CERN DEM BC; CreateDate: 30.07.2015; LatestRevisionDate: 30.07.2015
T10 = Si2315BDS-T1-E3: P-CHANNEL MOSFET WITH DIODE; Part Description: -12V -3A P-Channel STripFET® II Power MOSFET; Manufacturer: VISHAY SILICONIX; PressFit: No; Bonding: No; Part Number: Si2315BDS-T1-E3; Component Kind: Standard; Component Type: Standard; Device: Si2315BDS-T1-E3; PackageDescription: SOT, 0.95mm, pitch; 3 pin,1.30mm W X 2.92mm L X 1.12mm H body, IPC Medium Density; Manufacturer Part Number: Si2315BDS-T1-E3; Pin Count: 3; Case: SOT23-3; Mounted: Yes; Socket: No; SMD: Yes; Sense: No; ComponentHeight: 1.12mm; HelpURL: \\cern.ch\dfs\Applications\Altium\Datasheets\Si2315BDS-T1-E3.pdf; Author: CERN DEM JLC; CreateDate: 02.05.2011; LatestRevisionDate: 02.05.2011
T11 = BC857BV: 45V, 100mA PNP General Purpose Double Transistor; Part Description: -45V -100mA PNP General Purpose Double Transistor; Manufacturer: NXP SEMICONDUCTORS; PressFit: No; Bonding: No; Part Number: BC857BV; Component Kind: Standard; Component Type: Standard; Device: BC857BV; PackageDescription: SOTFL (SOT666), 0.50mm, Pitch; 6 Pin, 1.20mm W X 1.60mm L X 0.60mm H Body, IPC Medium Density; Manufacturer Part Number: BC857BV; Pin Count: 6; Case: SOT666; Mounted: Yes; Socket: No; SMD: Yes; Sense: No; ComponentHeight: 0.6mm; HelpURL: \\cern.ch\dfs\Applications\Altium\Datasheets\BC857BV.pdf; Author: CERN DEM JLC; CreateDate: 01.12.2011; LatestRevisionDate: 01.12.2011
T12 T13 T18 = BSS138LT1G: N-CHANNEL MOSFET WITH DIODE; Part Description: 50V 200mA N-Channel Enhancement Mode Field-Effect Transistor; Manufacturer: ON SEMICONDUCTOR; PressFit: No; Bonding: No; Part Number: BSS138LT1G; Component Kind: Standard; Component Type: Standard; Device: BSS138LT1G; PackageDescription: SOT23 3-Leads, Pitch 0.95mm - Body 1.4x3mm, IPC Medium Density; Manufacturer Part Number: BSS138LT1G; Pin Count: 3; Case: SOT23-3; Mounted: Yes; Socket: No; SMD: Yes; Sense: No; ComponentHeight: 1.11mm; HelpURL: \\cern.ch\dfs\Applications\Altium\Datasheets\BSS138LT1G.pdf; Author: CERN DEM JLC; CreateDate: 23.03.2009; LatestRevisionDate: 23.03.2009
TP17-TP20 = SMD_PAD_1.27X1.27MM: Part Description: 1.27mm x 1.27mm PCB Copper Area (SMD Test Point); Mounted: No; Part Number: SMD_PAD_1.27X1.27MM; Component Kind: Standard (No BOM); Component Type: Standard (No BOM); Pin Count: 1; Family: Test Point; Socket: No; SMD: Yes; Sense: No; Status: None; ComponentHeight: 0mm; HelpURL: Undefined; Author: CERN DEM JLC; CreateDate: 12.01.2008; LatestRevisionDate: 12.01.2008; PackageDescription: 1.27mm x 1.27mm PCB Copper Area (SMD Test Point)